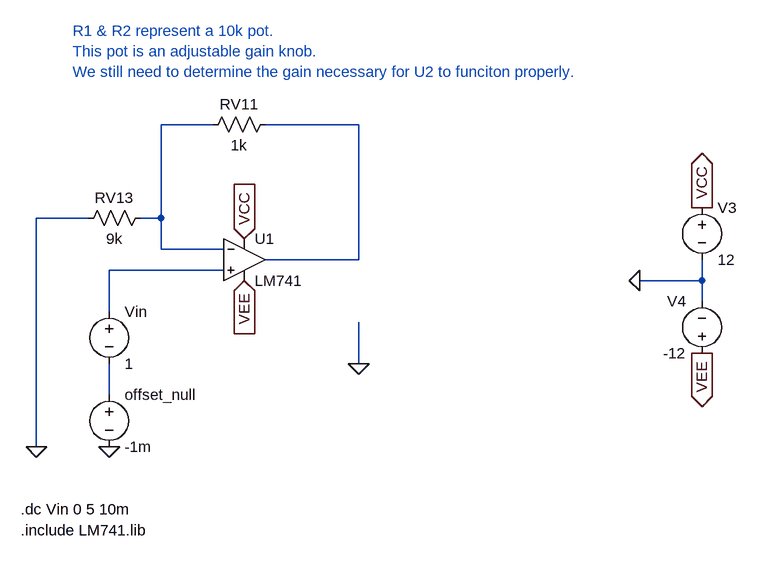
[diagram p0: schematic ProjectU1.asc]
ProjectU1.asc, the LTspice schematic file:
Version 4
SHEET 1 984 856
WIRE 16 -144 -64 -144
WIRE 240 -144 96 -144
WIRE -176 0 -256 0
WIRE -64 0 -64 -144
WIRE -64 0 -96 0
WIRE -64 48 -64 0
WIRE 32 48 -64 48
WIRE 240 64 240 -144
WIRE 240 64 96 64
WIRE 32 80 -144 80
WIRE 768 96 768 64
WIRE 768 96 672 96
WIRE 768 128 768 96
WIRE -144 144 -144 80
WIRE 240 224 240 160
WIRE -144 272 -144 224
WIRE -256 352 -256 0
FLAG 64 96 VEE
IOPIN 64 96 In
FLAG 64 32 VCC
IOPIN 64 32 In
FLAG 672 96 0
FLAG 768 -16 VCC
IOPIN 768 -16 Out
FLAG 768 208 VEE
IOPIN 768 208 Out
FLAG -144 352 0
FLAG -256 352 0
FLAG 240 224 0
SYMBOL voltage 768 -32 R0
SYMATTR InstName V3
SYMATTR Value 12
SYMBOL voltage 768 224 R180
WINDOW 0 24 96 Left 2
WINDOW 3 24 16 Left 2
SYMATTR InstName V4
SYMATTR Value -12
SYMBOL OpAmps\\opamp2 64 0 R0
SYMATTR InstName U1
SYMATTR Value LM741
SYMBOL voltage -144 256 R0
WINDOW 123 0 0 Left 0
WINDOW 39 0 0 Left 0
SYMATTR InstName offset_null
SYMATTR Value -1m
SYMBOL voltage -144 128 R0
WINDOW 123 0 0 Left 0
WINDOW 39 0 0 Left 0
SYMATTR InstName Vin
SYMATTR Value 1
SYMBOL res 112 -160 R90
WINDOW 0 0 56 VBottom 2
WINDOW 3 32 56 VTop 2
SYMATTR InstName RV11
SYMATTR Value 1k
SYMBOL res -80 -16 R90
WINDOW 0 0 56 VBottom 2
WINDOW 3 32 56 VTop 2
SYMATTR InstName RV13
SYMATTR Value 9k
TEXT -280 480 Left 2 !.include LM741.lib
TEXT -280 448 Left 2 !.dc Vin 0 5 10m
TEXT -200 -288 Left 2 ;R1 & R2 represent a 10k pot.\nThis pot is an adjustable gain knob.\nWe still need to determine the gain necessary for U2 to funciton properly.

The netlist it stands for:
* ProjectU1.asc
V3 VCC 0 12
V4 VEE 0 -12
XU1 N003 N001 VCC VEE N002 LM741  ; pins In+ In- V+ V- OUT
V§offset_null N004 0 -1m
Vin N003 N004 1
RV11 N002 N001 1k
RV13 N001 0 9k
.include LM741.lib
.dc Vin 0 5 10m
* R1 & R2 represent a 10k pot.
* This pot is an adjustable gain knob.
* We still need to determine the gain necessary for U2 to funciton properly.
.backanno
.end